# Altium schematic sheet 05-Front Panel SFP_1.SchDoc
size A3; Customer: 01910; SheetNumber: 4; SheetTotal: 15
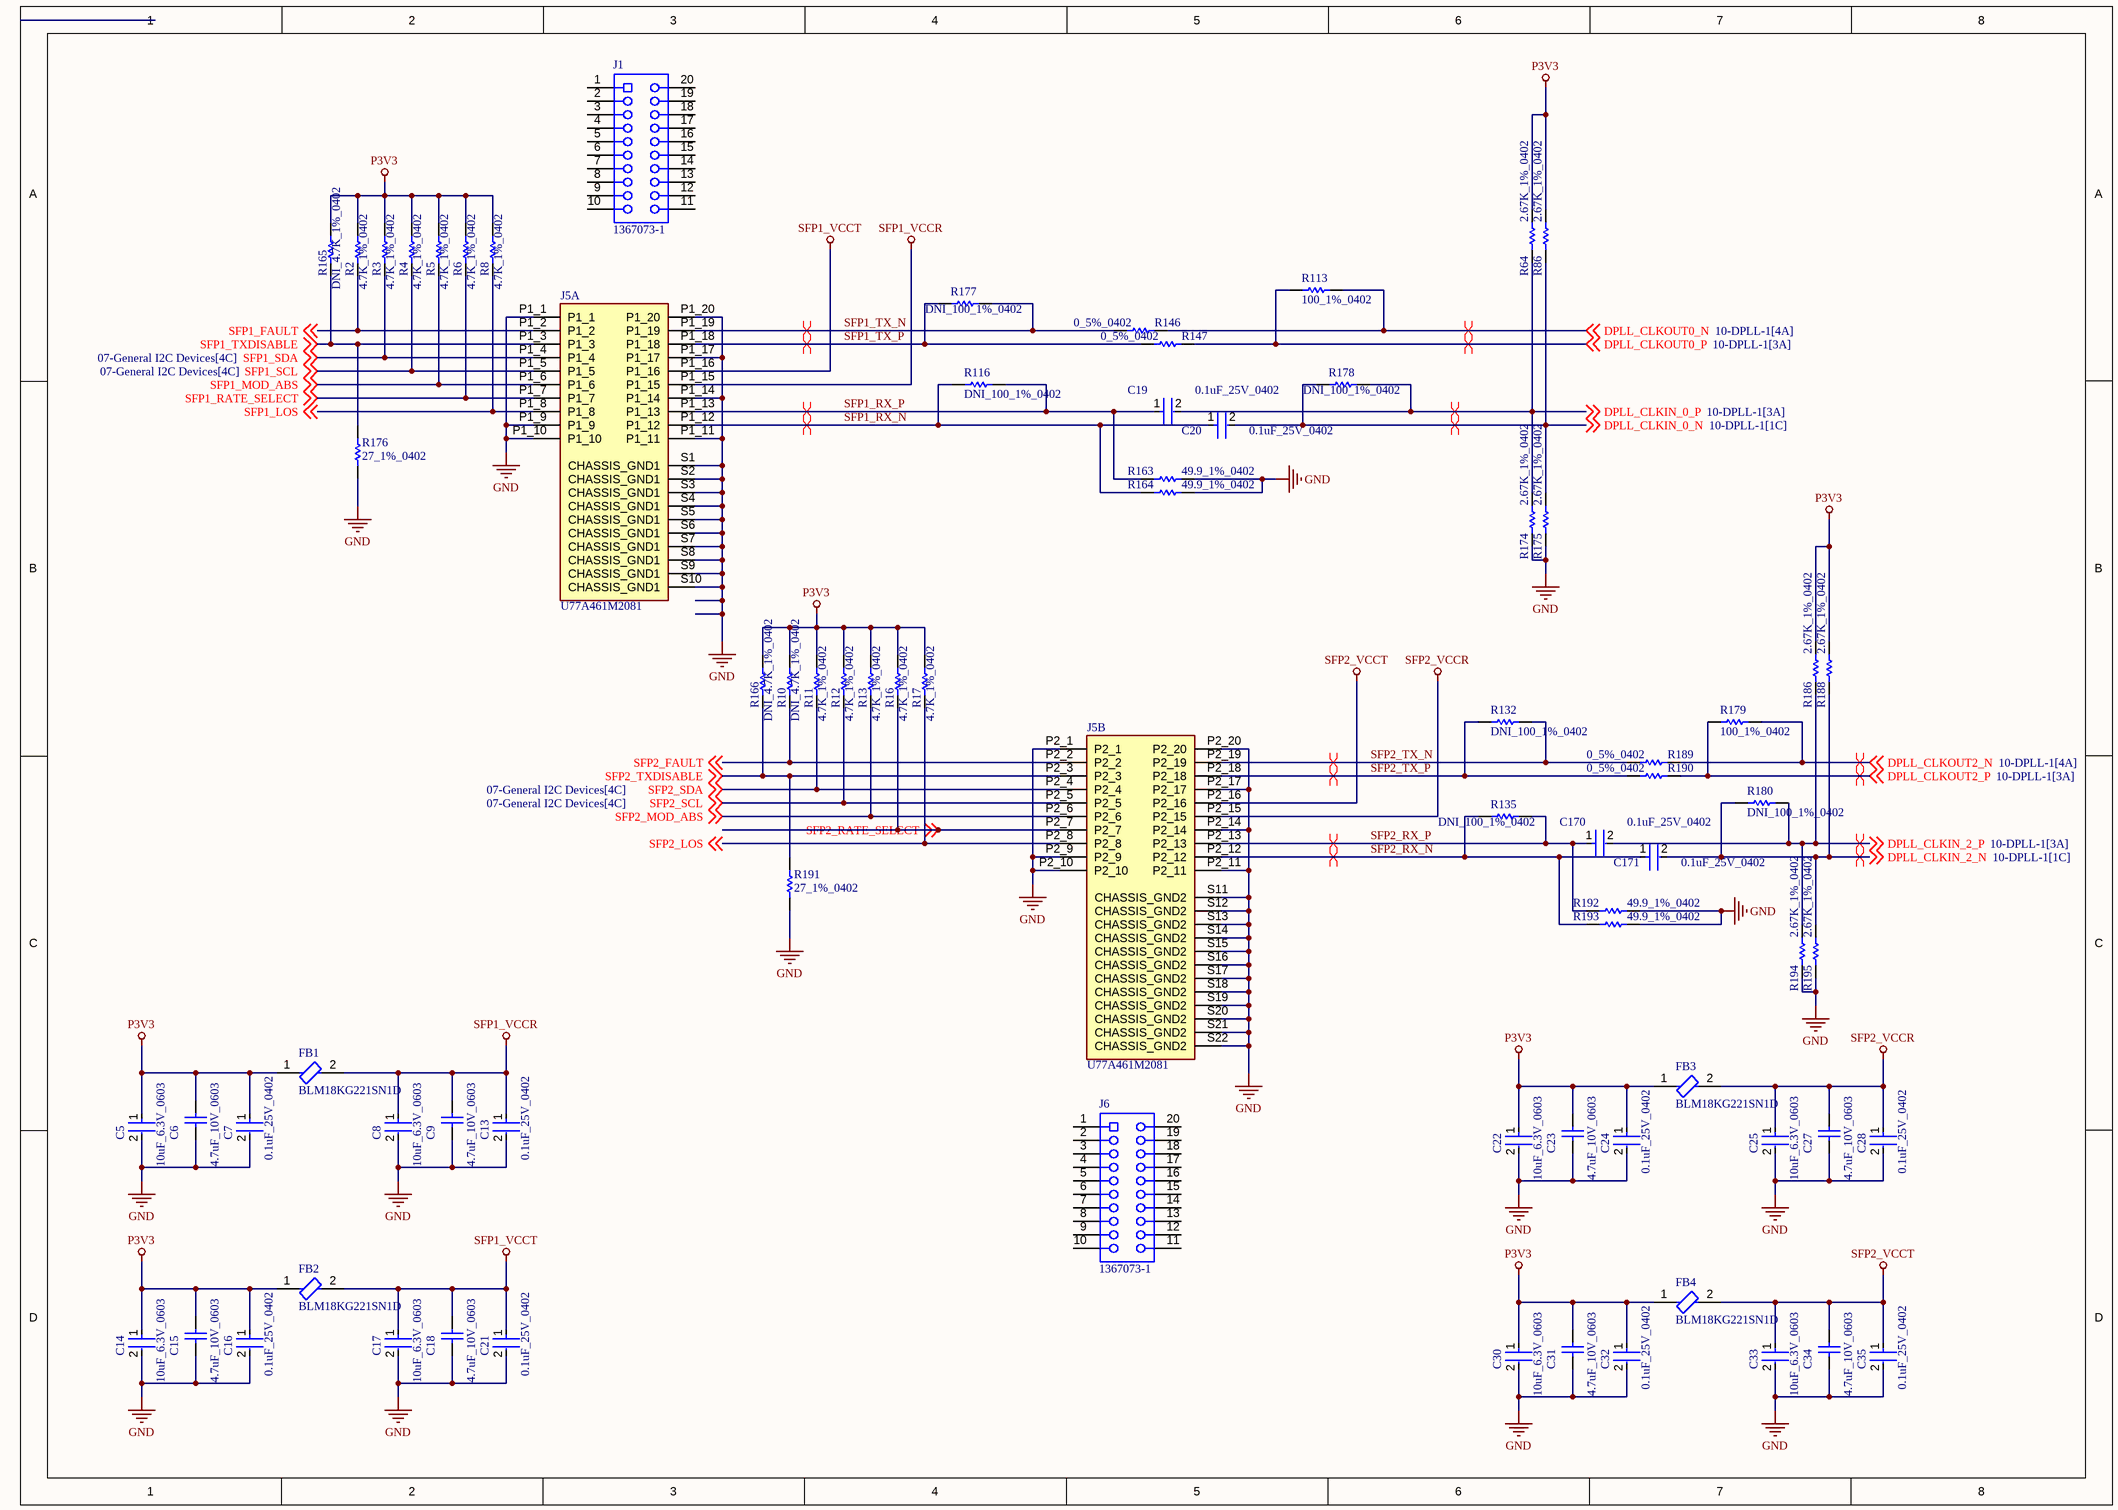
[diagram p0: 05-Front Panel SFP_1.SchDoc]

## Parts
C5  10uF_6.3V_0603  [FP-C0603C106M9PACTU-MFG]
C6  4.7uF_10V_0603  [CAPC1608X87X35NL15T15]
C7  0.1uF_25V_0402  [FP-0402-L_1_0_1-W_0_5_0_1-IPC_C]
C8  10uF_6.3V_0603  [FP-C0603C106M9PACTU-MFG]
C9  4.7uF_10V_0603  [CAPC1608X87X35NL15T15]
C13  0.1uF_25V_0402  [FP-0402-L_1_0_1-W_0_5_0_1-IPC_C]
C14  10uF_6.3V_0603  [FP-C0603C106M9PACTU-MFG]
C15  4.7uF_10V_0603  [CAPC1608X87X35NL15T15]
C16  0.1uF_25V_0402  [FP-0402-L_1_0_1-W_0_5_0_1-IPC_C]
C17  10uF_6.3V_0603  [FP-C0603C106M9PACTU-MFG]
C18  4.7uF_10V_0603  [CAPC1608X87X35NL15T15]
C19  0.1uF_25V_0402  [FP-0402-L_1_0_1-W_0_5_0_1-IPC_C]
C20  0.1uF_25V_0402  [FP-0402-L_1_0_1-W_0_5_0_1-IPC_C]
C21  0.1uF_25V_0402  [FP-0402-L_1_0_1-W_0_5_0_1-IPC_C]
C22  10uF_6.3V_0603  [FP-C0603C106M9PACTU-MFG]
C23  4.7uF_10V_0603  [CAPC1608X87X35NL15T15]
C24  0.1uF_25V_0402  [FP-0402-L_1_0_1-W_0_5_0_1-IPC_C]
C25  10uF_6.3V_0603  [FP-C0603C106M9PACTU-MFG]
C27  4.7uF_10V_0603  [CAPC1608X87X35NL15T15]
C28  0.1uF_25V_0402  [FP-0402-L_1_0_1-W_0_5_0_1-IPC_C]
C30  10uF_6.3V_0603  [FP-C0603C106M9PACTU-MFG]
C31  4.7uF_10V_0603  [CAPC1608X87X35NL15T15]
C32  0.1uF_25V_0402  [FP-0402-L_1_0_1-W_0_5_0_1-IPC_C]
C33  10uF_6.3V_0603  [FP-C0603C106M9PACTU-MFG]
C34  4.7uF_10V_0603  [CAPC1608X87X35NL15T15]
C35  0.1uF_25V_0402  [FP-0402-L_1_0_1-W_0_5_0_1-IPC_C]
C170  0.1uF_25V_0402  [FP-0402-L_1_0_1-W_0_5_0_1-IPC_C]
C171  0.1uF_25V_0402  [FP-0402-L_1_0_1-W_0_5_0_1-IPC_C]
FB1  BLM18KG221SN1D  [FP-BLM18-0_15-t0_8-IPC_B]
FB2  BLM18KG221SN1D  [FP-BLM18-0_15-t0_8-IPC_B]
FB3  BLM18KG221SN1D  [FP-BLM18-0_15-t0_8-IPC_B]
FB4  BLM18KG221SN1D  [FP-BLM18-0_15-t0_8-IPC_B]
J1  1367073-1  [TECO-1367073-1_V]
J5  U77A461M2081  [AMPHENOL_U77A461M2081]  (parts A,B of 4)
J6  1367073-1  [TECO-1367073-1_V]
R2  4.7K_1%_0402  [RESC1005X40X25NL10T10]
R3  4.7K_1%_0402  [RESC1005X40X25NL10T10]
R4  4.7K_1%_0402  [RESC1005X40X25NL10T10]
R5  4.7K_1%_0402  [RESC1005X40X25NL10T10]
R6  4.7K_1%_0402  [RESC1005X40X25NL10T10]
R8  4.7K_1%_0402  [RESC1005X40X25NL10T10]
R10  DNI_4.7K_1%_0402  [RESC1005X40X25NL10T10]  (no BOM)
R11  4.7K_1%_0402  [RESC1005X40X25NL10T10]
R12  4.7K_1%_0402  [RESC1005X40X25NL10T10]
R13  4.7K_1%_0402  [RESC1005X40X25NL10T10]
R16  4.7K_1%_0402  [RESC1005X40X25NL10T10]
R17  4.7K_1%_0402  [RESC1005X40X25NL10T10]
R64  2.67K_1%_0402  [RESC1005X40X25NL05T10]
R86  2.67K_1%_0402  [RESC1005X40X25NL05T10]
R113  100_1%_0402  [RESC1005X40X25NL05T10]
R116  DNI_100_1%_0402  [RESC1005X40X25NL05T10]  (no BOM)
R132  DNI_100_1%_0402  [RESC1005X40X25NL05T10]  (no BOM)
R135  DNI_100_1%_0402  [RESC1005X40X25NL05T10]  (no BOM)
R146  0_5%_0402  [RESC1005X40X25LL10T10]
R147  0_5%_0402  [RESC1005X40X25LL10T10]
R163  49.9_1%_0402  [RESC1005X40X25NL10T10]
R164  49.9_1%_0402  [RESC1005X40X25NL10T10]
R165  DNI_4.7K_1%_0402  [RESC1005X40X25NL10T10]  (no BOM)
R166  DNI_4.7K_1%_0402  [RESC1005X40X25NL10T10]  (no BOM)
R174  2.67K_1%_0402  [RESC1005X40X25NL05T10]
R175  2.67K_1%_0402  [RESC1005X40X25NL05T10]
R176  27_1%_0402  [RESC1005X40X25NL05T05]
R177  DNI_100_1%_0402  [RESC1005X40X25NL05T10]  (no BOM)
R178  DNI_100_1%_0402  [RESC1005X40X25NL05T10]  (no BOM)
R179  100_1%_0402  [RESC1005X40X25NL05T10]
R180  DNI_100_1%_0402  [RESC1005X40X25NL05T10]  (no BOM)
R186  2.67K_1%_0402  [RESC1005X40X25NL05T10]
R188  2.67K_1%_0402  [RESC1005X40X25NL05T10]
R189  0_5%_0402  [RESC1005X40X25LL10T10]
R190  0_5%_0402  [RESC1005X40X25LL10T10]
R191  27_1%_0402  [RESC1005X40X25NL05T05]
R192  49.9_1%_0402  [RESC1005X40X25NL10T10]
R193  49.9_1%_0402  [RESC1005X40X25NL10T10]
R194  2.67K_1%_0402  [RESC1005X40X25NL05T10]
R195  2.67K_1%_0402  [RESC1005X40X25NL05T10]

## Nets
GND: C5.2 C6.1 C7.2 C8.2 C9.1 C13.2 C14.2 C15.1 C16.2 C17.2 C18.1 C21.2 C22.2 C23.1 C24.2 C25.2 C27.1 C28.2 C30.2 C31.1 C32.2 C33.2 C34.1 C35.2 J5.P1_1 J5.P1_9 J5.P1_10 J5.P1_11 J5.P1_14 J5.P1_17 J5.P1_20 J5.P2_1 J5.P2_9 J5.P2_10 J5.P2_11 J5.P2_14 J5.P2_17 J5.P2_20 J5.S1(CHASSIS_GND1) J5.S2(CHASSIS_GND1) J5.S3(CHASSIS_GND1) J5.S4(CHASSIS_GND1) J5.S5(CHASSIS_GND1) J5.S6(CHASSIS_GND1) J5.S7(CHASSIS_GND1) J5.S8(CHASSIS_GND1) J5.S9(CHASSIS_GND1) J5.S10(CHASSIS_GND1) J5.S11(CHASSIS_GND2) J5.S12(CHASSIS_GND2) J5.S13(CHASSIS_GND2) J5.S14(CHASSIS_GND2) J5.S15(CHASSIS_GND2) J5.S16(CHASSIS_GND2) J5.S17(CHASSIS_GND2) J5.S18(CHASSIS_GND2) J5.S19(CHASSIS_GND2) J5.S20(CHASSIS_GND2) J5.S21(CHASSIS_GND2) J5.S22(CHASSIS_GND2) R163.2 R164.2 R174.1 R175.1 R176.1 R191.1 R192.2 R193.2 R194.1 R195.1
P3V3: C5.1 C6.2 C7.1 C14.1 C15.2 C16.1 C22.1 C23.2 C24.1 C30.1 C31.2 C32.1 FB1.1 FB2.1 FB3.1 FB4.1 R2.1 R3.1 R4.1 R5.1 R6.1 R8.1 R10.1 R11.1 R12.1 R13.1 R16.1 R17.1 R64.2 R86.2 R165.1 R166.1 R186.2 R188.2
SFP1_VCCR: C8.1 C9.2 C13.1 FB1.2 J5.P1_15
SFP1_VCCT: C17.1 C18.2 C21.1 FB2.2 J5.P1_16
SFP2_VCCR: C25.1 C27.2 C28.1 FB3.2 J5.P2_15
SFP2_VCCT: C33.1 C34.2 C35.1 FB4.2 J5.P2_16
DPLL_CLKIN_0_N: C20.2 R86.1 R175.2 R178.1 ; off-sheet DPLL_CLKIN_0_N
DPLL_CLKIN_0_P: C19.2 R64.1 R174.2 R178.2 ; off-sheet DPLL_CLKIN_0_P
DPLL_CLKIN_2_N: C171.2 R180.1 R188.1 R195.2 ; off-sheet DPLL_CLKIN_2_N
DPLL_CLKIN_2_P: C170.2 R180.2 R186.1 R194.2 ; off-sheet DPLL_CLKIN_2_P
DPLL_CLKOUT0_N: R113.2 R146.2 ; off-sheet DPLL_CLKOUT0_N
DPLL_CLKOUT0_P: R113.1 R147.2 ; off-sheet DPLL_CLKOUT0_P
DPLL_CLKOUT2_N: R179.2 R189.2 ; off-sheet DPLL_CLKOUT2_N
DPLL_CLKOUT2_P: R179.1 R190.2 ; off-sheet DPLL_CLKOUT2_P
SFP1_FAULT: J5.P1_2 R2.2 ; off-sheet SFP1_FAULT
SFP1_LOS: J5.P1_8 R8.2 ; off-sheet SFP1_LOS
SFP1_MOD_ABS: J5.P1_6 R5.2 ; off-sheet SFP1_MOD_ABS
SFP1_RATE_SELECT: J5.P1_7 R6.2 ; off-sheet SFP1_RATE_SELECT
SFP1_RX_N: C20.1 J5.P1_12 R116.1 R164.1
SFP1_RX_P: C19.1 J5.P1_13 R116.2 R163.1
SFP1_SCL: J5.P1_5 R4.2 ; off-sheet SFP1_SCL
SFP1_SDA: J5.P1_4 R3.2 ; off-sheet SFP1_SDA
SFP1_TX_N: J5.P1_19 R146.1 R177.2
SFP1_TX_P: J5.P1_18 R147.1 R177.1
SFP1_TXDISABLE: J5.P1_3 R165.2 R176.2 ; off-sheet SFP1_TXDISABLE
SFP2_FAULT: J5.P2_2 R10.2 ; off-sheet SFP2_FAULT
SFP2_LOS: J5.P2_8 R17.2 ; off-sheet SFP2_LOS
SFP2_MOD_ABS: J5.P2_6 R13.2 ; off-sheet SFP2_MOD_ABS
SFP2_RATE_SELECT: J5.P2_7 R16.2 ; off-sheet SFP2_RATE_SELECT
SFP2_RX_N: C171.1 J5.P2_12 R135.1 R193.1
SFP2_RX_P: C170.1 J5.P2_13 R135.2 R192.1
SFP2_SCL: J5.P2_5 R12.2 ; off-sheet SFP2_SCL
SFP2_SDA: J5.P2_4 R11.2 ; off-sheet SFP2_SDA
SFP2_TX_N: J5.P2_19 R132.2 R189.1
SFP2_TX_P: J5.P2_18 R132.1 R190.1
SFP2_TXDISABLE: J5.P2_3 R166.2 R191.2 ; off-sheet SFP2_TXDISABLE

Not connected (* = marked no-connect by the designer): J1 1 2 3 4 5 6 7 8 9 10 11 12 13 14 15 16 17 18 19 20; J6 1 2 3 4 5 6 7 8 9 10 11 12 13 14 15 16 17 18 19 20

## Layout directives
differential pair: DPLL_CLKIN_0_N, DPLL_CLKIN_0_P, DPLL_CLKIN_2_N, DPLL_CLKIN_2_P, DPLL_CLKOUT0_N, DPLL_CLKOUT0_P, DPLL_CLKOUT2_N, DPLL_CLKOUT2_P, SFP1_RX_N, SFP1_RX_P, SFP1_TX_N, SFP1_TX_P, SFP2_RX_N, SFP2_RX_P, SFP2_TX_N, SFP2_TX_P

## Notes on the sheet
- SHEET
- REV
- timingcard.com <http://timingcard.com>
- DATE
- OF

## Library data of the parts
C5 C8 C14 C17 C22 C25 C30 C33 = CMP-2006-02285-3: CAP CER 10UF 6.3V X5R 0603; Manufacturer Part Number: C0603C106M9PACTU; Manufacturer: Kemet; Material: Ceramic; Temperature Coefficient: 15%; Tolerance: 20%; Category: Cap; Height: 0.9mm; Digikey Description: CAP CER 10UF 6.3V X5R 0603; Mouser Description: In a Pack of 10, KEMET 0603 (1608M) 10µF MLCC 6.3V dc ±20% SMD C0603C106M9PACTU; Voltage Rating: 6.3V; Device Class L2: Capacitors; Temperature Range Low: -55°C; Temperature Characteristic: X5R; ComponentLink2Description: Datasheet; Ipc Land Pattern Name: CAPC16080X80; ComponentLink2URL: http://www.kemet.com/Lists/ProductCatalog/Attachments/19/KEM_C1006_X5R_SMD.pdf; Capacitance: 10uF; Temperature Range High: +85°C; Device Class L3: Ceramic Capacitors; RoHS: TRUE; Automotive: No; Value: 10uF; Temperature: -55°C to +85°C; Device Class L1: Passive Components; Package: C0603C106M9PACTU; Lead Free: Yes; Octopart: https://octopart.com/c0603c106m9pactu-kemet-8375727
C6 C9 C15 C18 C23 C27 C31 C34 = CMP-2006-03238-1: Part Number: C0603C475K8PACTU; Manufacturer: Kemet
C7 C13 C16 C19-C21 C24 C28 C32 C35 C170 C171 = CMP-2008-02519-2: General Purpose Ceramic Capacitor, 0402, 100nF, 10%, X7R, 15%, 25V; Package Quantity: 1; Capacitance: 100nF; Min Operating Temperature: -55°C; Voltage: 25V; Voltage Rating: 25V; Construction: Flat; Max Operating Temperature: 125°C; Radiation Hardening: No; Depth: 0.5mm; Thickness: 0.022inch; Voltage Rating (DC): 25V; Number of Pins: 2; Lead Free: Lead Free; Series: -; REACH SVHC: No SVHC; Length: 1mm; Dielectric: X7R; RoHS Compliant: Yes; Mount: Surface Mount; Packaging: Tape and Reel; Case/Package: 0402; Case Code (Imperial): 0402; Termination: SMD/SMT; Width: 0.02inch; Case Code (Metric): 1005; Tolerance: 10%
FB1-FB4 = CMP-0686-00556-7: Chip Ferrite Bead, 0603, 220Ω @ 100MHz, 0.05Ω, 25%, 2.2A; DC Resistance (DCR): 50mR; Number of Circuits: 1; Impedance: 220R; Current Rating: 2.2A; Material: Ferrite; Test Frequency: 100MHz; Depth: 0.8mm; Series: BLM18K; RoHS Compliant: Yes; Termination: SMD/SMT; Max Current Rating: 2.2A; Case Code (Metric): 1608; Radiation Hardening: No; Number of Pins: 2; Length: 1.6mm; Lead Free: Lead Free; Package Quantity: 1; Height: 0.8mm; Core Material: Ferrite; Inductor Type: FERRITE BEAD; Min Operating Temperature: -55°C; Case/Package: 0603; Case Code (Imperial): 0603; Number of Lines: 1; Packaging: Tape and Reel; REACH SVHC: No SVHC; Max Operating Temperature: 125°C; Military Standard: Not; DC Resistance-Max: 50mR; Width: 0.8mm; DC Current: 2.2A; Max DC Current: 2.2A; Tolerance: 25%; Weight: 7.1E-05oz
J1 J6 = CMP-2000-05488-1: Female Connector, Pitch 0.8 mm, 2 x 10 Position, Height 5.4 mm, -55 to 85 degC, RoHS, Tape and Reel; Manufacturer: TE Connectivity; Product Training Modules: HighSpeedPluggableI/OSolutions; 3D Model: 1367073-1.pdf; Connector Type: SFP; Other Names: A97430DKR; Mating Products: 516-2084-ND / -TXRXOPTICALSFF1.25GBDISCSI; Dynamic Catalog: SFPConnectors; Featured Product: HighSpeedPluggableI-OSolutions; Connector Style: Receptacle; Associated Product: A103997CT-ND / -CONNSFPCAGESINGLEW/OPIPE / A103997TR-ND / -CONNSFPCAGESINGLEW/OPIPE / 1367645-3-ND / -CONNCAGE&HEATSINKSGLPORTTIN / 1367645-2-ND / -CONNCAGE&HEATSINKSGLPORTTIN / 1888424-1-ND / -CONNCAGE1X2SFPENHANCEDEMI / 1367643-1-ND / -CONNCAGESNGLPORTDBLSIDETIN / 1489962-1-ND / -CONNSFPCAGESINGLEW/OPIPE / 1367645-1-ND / -CONNCAGE&HEATSINKSGLPORTTIN / A99375-ND / -CONNSFPCAGE1X4PIN-IN-PASTE / A97412CT-ND / -CONNSFPLOWERCAGEPCB / More...; Number of Positions: 20; Package Reference: 1367073-1; Package Description: Female Connector, Pitch 0.8 mm, 2 x 10 Position, Height 5.4 mm; RoHS Information: 1367073-1StatementofCompliance; Contact Finish: Gold; Datasheet URL: http://www.te.com/commerce/DocumentDelivery/DDEController?Action=showdoc&DocId=Customer+Drawing%7F1367073%7FK%7Fpdf%7FEnglish%7FENG_CD_1367073_K.pdf%7F1367073-1; Datasheet Version: Rev. K, 12/2012; Contact Finish Thickness: 15µin(0.38µm); Category: Connectors,Interconnects; Mounting Type: SurfaceMount,RightAngle; Mounting Technology: SurfaceMount; Packaging: Digi-Reel®; Manufacturer URL: http://www.te.com/; Family: PluggableConnectors; Standard Package: 1; Termination: Solder
J5 = U77A461M2081: MF: AMPHENOL ICC / FCI; Package: None; Price: None; Value: *; MP: U77A461M2081; Availability: Unavailable
R2-R6 R8 R10-R13 R16 R17 R165 R166 = CMP-2002-05217-1: Manufacturer: Bourns; Part Number: CR0402-FX-4701GLF
R64 R86 R174 R175 R186 R188 R194 R195 = CMP-2002-07574-1: Manufacturer: Yageo; Part Number: RC0402FR-072K67L
R113 R116 R132 R135 R177-R180 = CMP-2002-07853-1: Manufacturer: Yageo; Part Number: RC0402FR-13100RL
R146 R147 R189 R190 = CMP-2002-04569-1: Manufacturer: KOA Speer; Part Number: RK73Z1ETTP
R163 R164 R192 R193 = CMP-2002-04448-1: Part Number: RK73H1ETTP49R9F; Manufacturer: KOA Speer
R176 R191 = CMP-2002-08434-1: Part Number: CRCW040227R0FKED; Manufacturer: Vishay Dale